# EAGLE design Nixie_noTube_final (EAGLE 7.6.0)
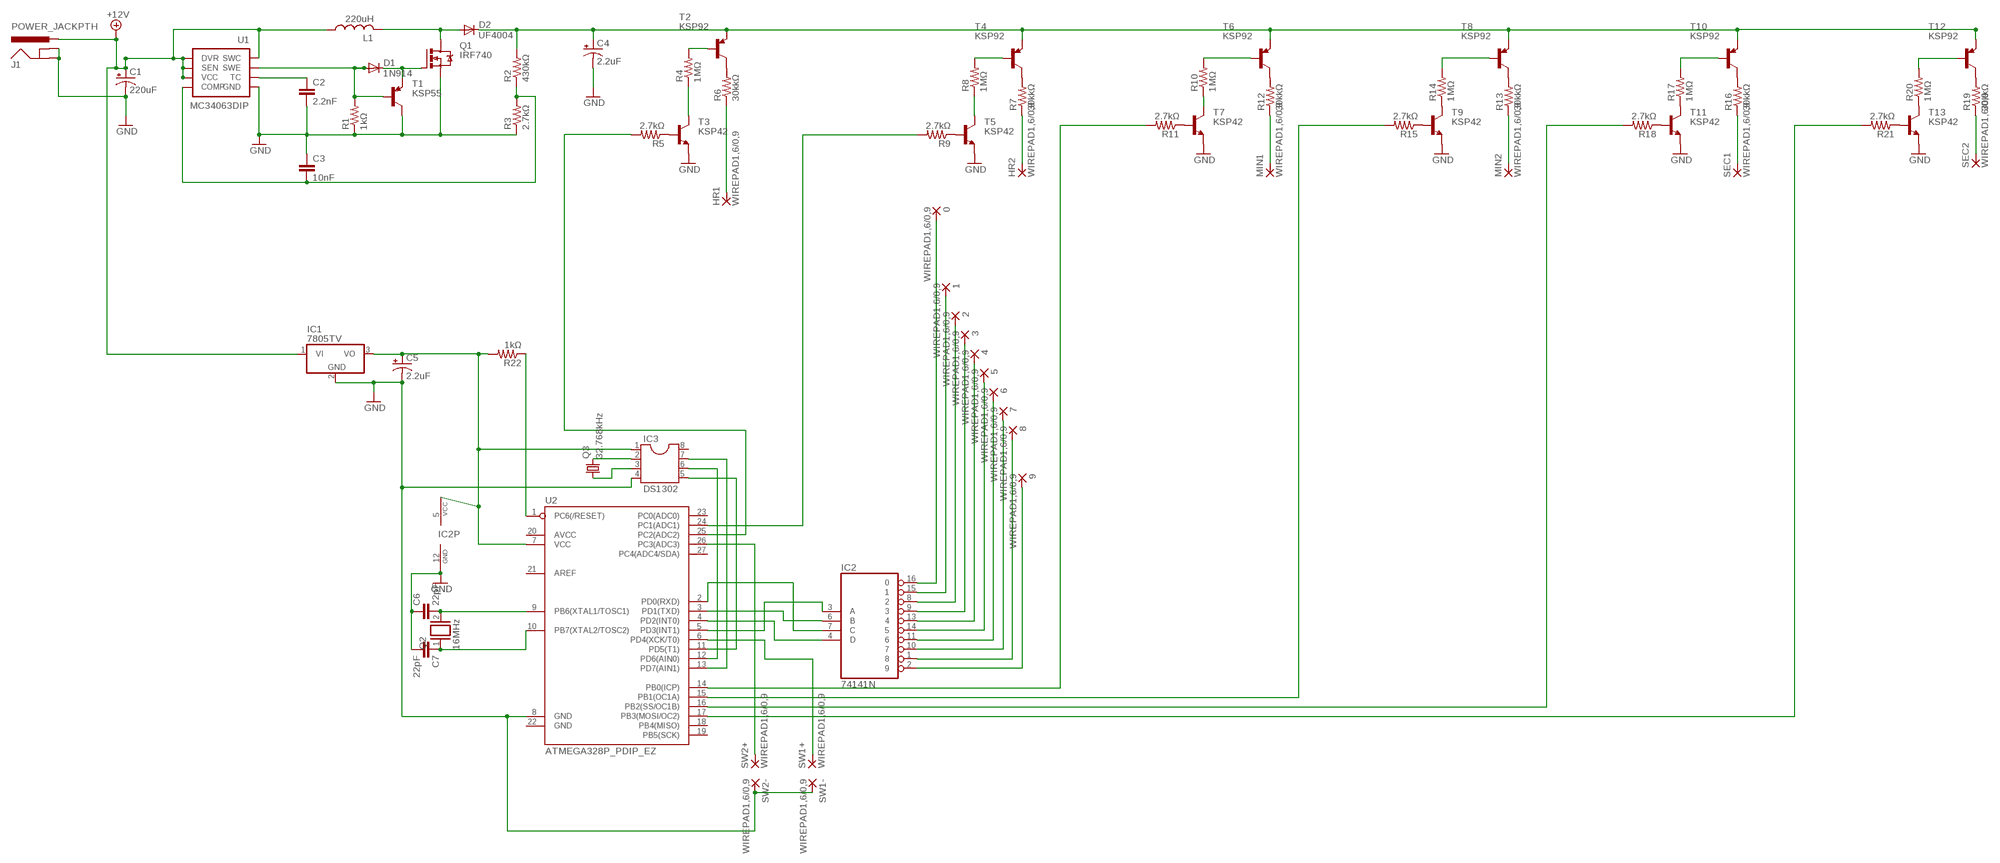
[diagram p0: schematic, sheet 1]

## Parts
0  WIREPAD1,6/0,9  [1,6/0,9]
1  WIREPAD1,6/0,9  [1,6/0,9]
2  WIREPAD1,6/0,9  [1,6/0,9]
3  WIREPAD1,6/0,9  [1,6/0,9]
4  WIREPAD1,6/0,9  [1,6/0,9]
5  WIREPAD1,6/0,9  [1,6/0,9]
6  WIREPAD1,6/0,9  [1,6/0,9]
7  WIREPAD1,6/0,9  [1,6/0,9]
8  WIREPAD1,6/0,9  [1,6/0,9]
9  WIREPAD1,6/0,9  [1,6/0,9]
C1  220uF  CAP_POLPTH1  [CPOL-RADIAL-100UF-25V]
C2  2.2nF  CAPEZ  [CAP-PTH-SMALLEZ]
C3  10nF  CAPEZ  [CAP-PTH-SMALLEZ]
C4  2.2uF  CAP_POLPTH1  [CPOL-RADIAL-100UF-25V]
C5  2.2uF  CAP_POLPTH1  [CPOL-RADIAL-100UF-25V]
C6  22pF  C2,5-3  [C2.5-3]
C7  22pF  C2,5-3  [C2.5-3]
D1  1N914  1N4004  [DO41-10]
D2  UF4004  1N4004  [DO41-10]
HR1  WIREPAD1,6/0,9  [1,6/0,9]
HR2  WIREPAD1,6/0,9  [1,6/0,9]
IC1  7805TV  [TO220V]
IC2  74141N  [DIL16]
IC3  DS1302  DIL8  [DIL08]
J1  POWER_JACKPTH  [POWER_JACK_PTH]
L1  220uH  L-US6000-XXX-RC  [6000-XXXX-RC]
MIN1  WIREPAD1,6/0,9  [1,6/0,9]
MIN2  WIREPAD1,6/0,9  [1,6/0,9]
Q1  IRF740  [TO220BV]
Q2  16MHz  XTAL/S  [QS]
Q3  32.768kHz  CRYSTALTC26H  [TC26H]
R1  1kΩ  R-US_0204/7  [0204/7]
R2  430kΩ  R-US_0204/7  [0204/7]
R3  2.7kΩ  R-US_0204/7  [0204/7]
R4  1MΩ  R-US_0204/7  [0204/7]
R5  2.7kΩ  R-US_0204/7  [0204/7]
R6  30kkΩ  R-US_0204/7  [0204/7]
R7  30kkΩ  R-US_0204/7  [0204/7]
R8  1MΩ  R-US_0204/7  [0204/7]
R9  2.7kΩ  R-US_0204/7  [0204/7]
R10  1MΩ  R-US_0204/7  [0204/7]
R11  2.7kΩ  R-US_0204/7  [0204/7]
R12  30kkΩ  R-US_0204/7  [0204/7]
R13  30kkΩ  R-US_0204/7  [0204/7]
R14  1MΩ  R-US_0204/7  [0204/7]
R15  2.7kΩ  R-US_0204/7  [0204/7]
R16  30kkΩ  R-US_0204/7  [0204/7]
R17  1MΩ  R-US_0204/7  [0204/7]
R18  2.7kΩ  R-US_0204/7  [0204/7]
R19  30kkΩ  R-US_0204/7  [0204/7]
R20  1MΩ  R-US_0204/7  [0204/7]
R21  2.7kΩ  R-US_0204/7  [0204/7]
R22  1kΩ  R-US_0204/7  [0204/7]
SEC1  WIREPAD1,6/0,9  [1,6/0,9]
SEC2  WIREPAD1,6/0,9  [1,6/0,9]
SW1+  WIREPAD1,6/0,9  [1,6/0,9]
SW1-  WIREPAD1,6/0,9  [1,6/0,9]
SW2+  WIREPAD1,6/0,9  [1,6/0,9]
SW2-  WIREPAD1,6/0,9  [1,6/0,9]
T1  KSP55  -PNP-TO92-EBC  [TO92-EBC]
T2  KSP92  -PNP-TO92  [TO92]
T3  KSP42  -NPN-TO92  [TO92]
T4  KSP92  -PNP-TO92  [TO92]
T5  KSP42  -NPN-TO92  [TO92]
T6  KSP92  -PNP-TO92  [TO92]
T7  KSP42  -NPN-TO92  [TO92]
T8  KSP92  -PNP-TO92  [TO92]
T9  KSP42  -NPN-TO92  [TO92]
T10  KSP92  -PNP-TO92  [TO92]
T11  KSP42  -NPN-TO92  [TO92]
T12  KSP92  -PNP-TO92  [TO92]
T13  KSP42  -NPN-TO92  [TO92]
U1  MC34063DIP  [DIP-08]
U2  ATMEGA328P_PDIP_EZ  [DIL28-EZ]

## Nets
200V: C4.1(+) D2.C R2.2 T2.1(E) T4.1(E) T6.1(E) T8.1(E) T10.1(E) T12.1(E)
+12V: C1.1(+) IC1.1(VI) J1.PWR L1.1 U1.1(SWC) U1.6(VCC) U1.7(SEN) U1.8(DVR)
GND: C1.2(-) C2.2 C3.1 C4.2(-) C5.2(-) C6.1 C7.2 IC1.2(GND) IC2.12(GND) IC3.4 J1.GND J1.GNDBREAK Q1.S R1.1 R3.1 SW1-.1(P) SW2-.1(P) T1.C T3.1(E) T5.1(E) T7.1(E) T9.1(E) T11.1(E) T13.1(E) U1.4(GND) U2.8(GND)
H1: HR2.1(P) R7.1
N$1: C2.1 U1.3(TC)
N$2: C3.2 R2.1 R3.2 U1.5(COMP)
N$3: D1.A R1.2 T1.B U1.2(SWE)
N$4: D1.C Q1.G T1.E
N$5: D2.A L1.2 Q1.D
N$6: R19.1 SEC2.1(P)
N$7: R11.1 T7.2(B)
N$8: R6.2 T2.3(C)
N$9: R4.2 T2.2(B)
N$10: R4.1 T3.3(C)
N$11: R5.1 T3.2(B)
N$12: HR1.1(P) R6.1
N$13: R7.2 T4.3(C)
N$14: R9.1 T5.2(B)
N$15: R8.2 T4.2(B)
N$16: R8.1 T5.3(C)
N$18: R12.2 T6.3(C)
N$19: R10.1 T7.3(C)
N$20: MIN1.1(P) R12.1
N$21: R10.2 T6.2(B)
N$22: R13.2 T8.3(C)
N$23: R14.1 T9.3(C)
N$24: R15.1 T9.2(B)
N$25: R14.2 T8.2(B)
N$26: MIN2.1(P) R13.1
N$27: R16.2 T10.3(C)
N$28: R17.1 T11.3(C)
N$29: R18.1 T11.2(B)
N$30: R17.2 T10.2(B)
N$31: R16.1 SEC1.1(P)
N$32: R19.2 T12.3(C)
N$33: R20.1 T13.3(C)
N$34: R21.1 T13.2(B)
N$35: R20.2 T12.2(B)
N$37: R22.1 U2.1(PC6(/RESET))
N$38: C5.1(+) IC1.3(VO) IC2.5(VCC) IC3.1 R22.2 U2.7(VCC)
N$39: IC2.6(B) U2.3(PD1(TXD))
N$40: C6.2 Q2.2 U2.9(PB6(XTAL1/TOSC1))
N$41: C7.1 Q2.1 U2.10(PB7(XTAL2/TOSC2))
N$42: IC2.7(C) U2.2(PD0(RXD))
N$43: IC2.4(D) U2.4(PD2(INT0))
N$44: IC2.3(A) U2.5(PD3(INT1))
N$45: 0.1(P) IC2.16
N$46: 1.1(P) IC2.15
N$47: 2.1(P) IC2.8
N$48: 3.1(P) IC2.9
N$49: 4.1(P) IC2.13
N$50: 5.1(P) IC2.14
N$51: 6.1(P) IC2.11
N$52: 7.1(P) IC2.10
N$53: 8.1(P) IC2.1
N$54: 9.1(P) IC2.2
N$55: SW1+.1(P) U2.6(PD4(XCK/T0))
N$56: SW2+.1(P) U2.26(PC3(ADC3))
N$57: R5.2 U2.25(PC2(ADC2))
N$58: R9.2 U2.24(PC1(ADC1))
N$59: R11.2 U2.14(PB0(ICP))
N$60: R15.2 U2.15(PB1(OC1A))
N$61: R18.2 U2.16(PB2(SS/OC1B))
N$62: R21.2 U2.17(PB3(MOSI/OC2))
N$63: IC3.2 Q3.2
N$64: IC3.3 Q3.1
N$66: IC3.5 U2.11(PD5(T1))
N$67: IC3.6 U2.12(PD6(AIN0))
N$68: IC3.7 U2.13(PD7(AIN1))
Unconnected: IC3.8 U2.18(PB4(MISO)) U2.19(PB5(SCK)) U2.20(AVCC) U2.21(AREF) U2.22(GND) U2.23(PC0(ADC0)) U2.27(PC4(ADC4/SDA))

## Library data of the parts
0 1-9 HR1 HR2 MIN1 MIN2 SEC1 SEC2 SW1+ SW1- SW2+ SW2- = wirepad:WIREPAD: Wire PAD connect wire on PCB
C1 C4 C5 = SparkFun-Capacitors:CAP_POL: Capacitor Polarized These are standard SMD and PTH capacitors. Normally 10uF, 47uF, and 100uF in electrolytic and tantalum varieties. Always verify the external diameter of the through hole cap, it varies with capacity, voltage, and manufacturer. The EIA devices should be standard.
C2 C3 = SparkFun-Capacitors:CAP: Capacitor Standard 0603 ceramic capacitor, and 0.1" leaded capacitor.
C6 C7 = capacitor-wima:C: CAPACITOR naming: grid - package width
D1 D2 = diode:1N4004: DIODE general purpose rectifier, 1 A
IC1 = linear:78*: Positive VOLTAGE REGULATOR Source: http://cache.national.com/ds/LM/LM78L05.pdf http://www.fairchildsemi.com/ds/LM/LM7805.pdf
IC2 = 74xx-us:74*141: BCD to decimal DECODER/DRIVER
IC3 = ic-package:DIL8: Dual In Line / Socket
J1 = SparkFun-Connectors:POWER_JACK: Power Jack This is the standard 5.5mm barrel jack for power. The PTH is the most common, proven, reliable, footprint. The Slot footprint only works if the mill layer is transmitted to the PCB fab house so be warned. Mating wall wart : TOL-00298 (and others); PROD_ID: CONN-08197
L1 = rcl:L-US: INDUCTOR, American symbol
Q1 = transistor-power:IRF740: N-CHANNEL MOS FET
Q2 = special:XTAL/S: CRYSTAL
Q3 = crystal:CRYSTAL: CRYSTAL; OC_FARNELL: unknown; OC_NEWARK: unknown
R1-R22 = resistor:R-US_: RESISTOR, American symbol
T1 = transistor-neu-to92:*-PNP-: PNP Transistror
T2 T4 T6 T8 T10 T12 = transistor:*-PNP-: PNP Transistror
T3 T5 T7 T9 T11 T13 = transistor:*-NPN-: NPN Transistror BF959 corrected 2008.03.06
U1 = SparkFun-PowerIC:MC34063: Jellybean switching supply controller
U2 = SparkFun-DigitalIC:ATMEGA328P_PDIP_EZ: uC used in the Arduino 32kb flash, 1k EEPROM, 2k SRAM This is the through-hole version of this chip.

## Board
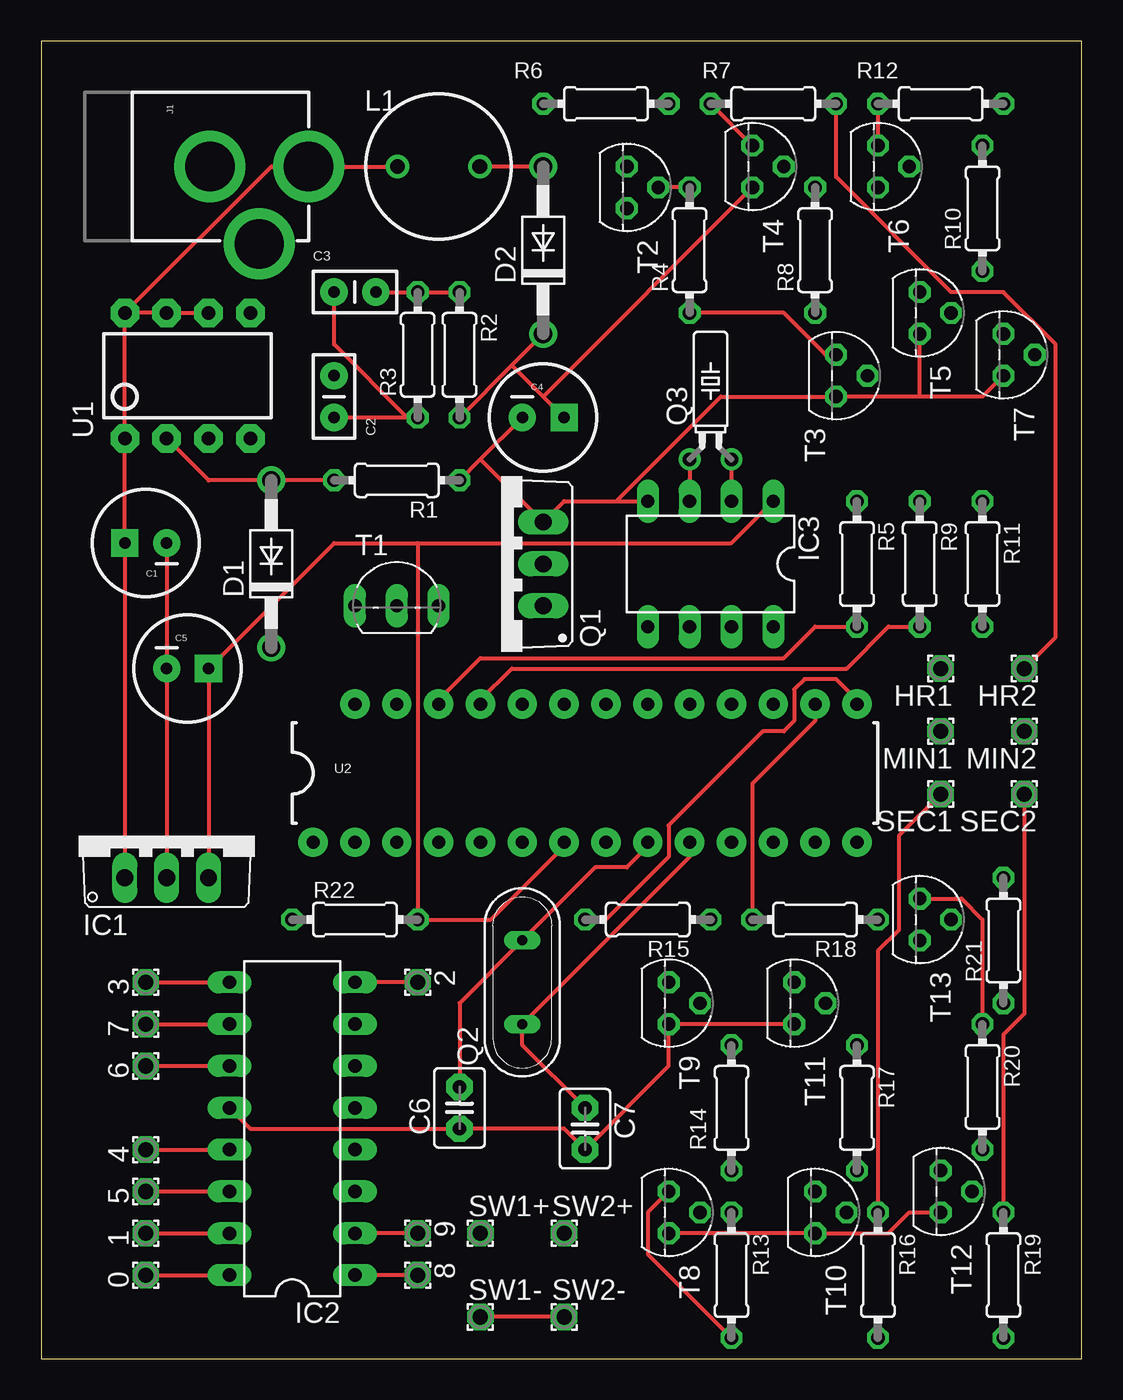
[diagram p1: board, top side]
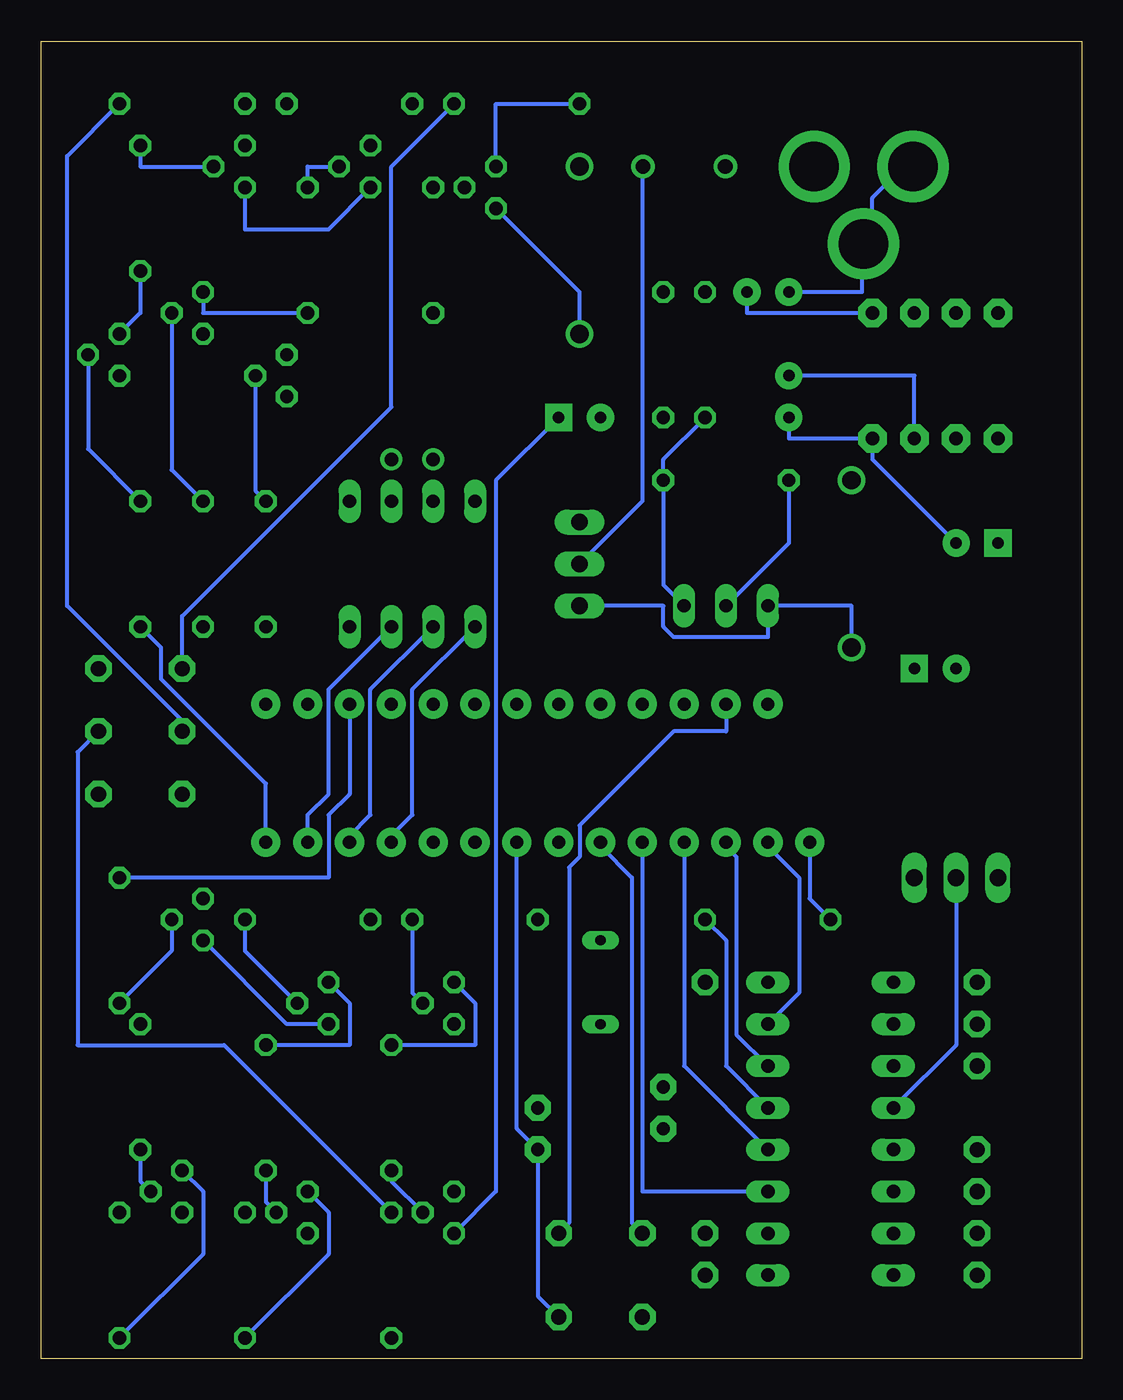
[diagram p2: board, bottom side, seen from below]

Size 63.17 x 80 mm. Coordinates in mm from the lower left corner, seen from the top.
Outline: 0,0 63.17,0 63.17,80 0,80 0,0
Copper layers (1*16): Top 0.035mm / dielectric 1.5mm / Bottom 0.035mm
Design rules "default": minimum track width 10mil, minimum drill 24mil, track to track 8mil, track to pad 8mil, pad to pad 8mil, via to via 8mil, smd to smd 8mil, copper to edge 40mil, drill to drill 8mil, minimum pad ring 10mil, minimum via ring 8mil, stop-mask expansion 4mil, vias tented up to drill 0mil, thermal gap 10mil

### Footprints (pad centres in the part's own frame; a part is rotated, then mirrored left to right if it is on the bottom)
1,6/0,9 = drill 0.914 pad 1.6 octagon: 1 0,0
CPOL-RADIAL-100UF-25V = drill 0.7 pad 1.651 square: 1 1.27,0 | drill 0.7 pad 1.651: 2 -1.27,0
CAP-PTH-SMALLEZ = drill 0.7 pad 1.651: 1 0,0; 2 2.54,0
C2.5-3 = drill 0.813 pad 1.6 octagon: 1 -1.27,0; 2 1.27,0
DO41-10 = drill 1.118: A 5.08,0; C -5.08,0
TO220V = drill 1.016 long: 1 -2.54,-2.54; 2 0,-2.54; 3 2.54,-2.54
DIL16 = drill 0.813 long: 1 -8.89,-3.81; 2 -6.35,-3.81; 3 -3.81,-3.81; 4 -1.27,-3.81; 5 1.27,-3.81; 6 3.81,-3.81; 7 6.35,-3.81; 8 8.89,-3.81; 9 8.89,3.81; 10 6.35,3.81; 11 3.81,3.81; 12 1.27,3.81; 13 -1.27,3.81; 14 -3.81,3.81; 15 -6.35,3.81; 16 -8.89,3.81
DIL08 = drill 0.813 long: 1 -3.81,-3.81; 2 -1.27,-3.81; 3 1.27,-3.81; 4 3.81,-3.81; 5 3.81,3.81; 6 1.27,3.81; 7 -1.27,3.81; 8 -3.81,3.81
POWER_JACK_PTH = drill 2.997 pad 4.318: GND 0,7.7; GNDBREAK 4.7,10.7; PWR 0,13.7
6000-XXXX-RC = drill 0.9 pad 1.422: 1 -2.5,0; 2 2.5,0
TO220BV = drill 1.016 long: D 0,-2.54; G -2.54,-2.54; S 2.54,-2.54
QS = drill 0.61 long: 1 -2.54,0; 2 2.54,0
TC26H = drill 0.813: 1 -1.27,0; 2 1.27,0
0204/7 = drill 0.813 octagon: 1 -3.81,0; 2 3.81,0
TO92-EBC = drill 0.813 long: B 0,-1.27; C 2.54,-1.27; E -2.54,-1.27
TO92 = drill 0.813 octagon: 1 1.27,0; 2 0,1.905; 3 -1.27,0
DIP-08 = drill 0.813 pad 1.727 octagon: 1 -3.81,-3.81; 2 -1.27,-3.81; 3 1.27,-3.81; 4 3.81,-3.81; 5 3.81,3.81; 6 1.27,3.81; 7 -1.27,3.81; 8 -3.81,3.81
DIL28-EZ = drill 0.8 pad 1.778: 1 -16.51,-4.191; 2 -13.97,-4.191; 3 -11.43,-4.191; 4 -8.89,-4.191; 5 -6.35,-4.191; 6 -3.81,-4.191; 7 -1.27,-4.191; 8 1.27,-4.191; 9 3.81,-4.191; 10 6.35,-4.191; 11 8.89,-4.191; 12 11.43,-4.191; 13 13.97,-4.191; 14 16.51,-4.191; 15 16.51,4.191; 16 13.97,4.191; 17 11.43,4.191; 18 8.89,4.191; 19 6.35,4.191; 20 3.81,4.191; 21 1.27,4.191; 22 -1.27,4.191; 23 -3.81,4.191; 24 -6.35,4.191; 25 -8.89,4.191; 26 -11.43,4.191; 27 -13.97,4.191

### Placement (x,y rotation side)
0  6.35,5.08 90 top
1  6.35,7.62 90 top
2  22.86,22.86 270 top
3  6.35,22.86 90 top
4  6.35,12.7 90 top
5  6.35,10.16 90 top
6  6.35,17.78 90 top
7  6.35,20.32 90 top
8  22.86,5.08 270 top
9  22.86,7.62 270 top
C1  6.35,49.53 180 top
C2  17.78,59.69 270 top
C3  17.78,64.77 0 top
C4  30.48,57.15 0 top
C5  8.89,41.91 0 top
C6  25.4,15.24 90 top
C7  33.02,13.97 270 top
D1  13.97,48.26 90 top
D2  30.48,67.31 90 top
HR1  54.61,41.91 180 top
HR2  59.69,41.91 180 top
IC1  7.62,31.75 0 top
IC2  15.24,13.97 90 top
IC3  40.64,48.26 180 top
J1  2.54,72.39 270 top
L1  24.13,72.39 0 top
MIN1  54.61,38.1 180 top
MIN2  59.69,38.1 180 top
Q1  27.94,48.26 90 top
Q2  29.21,22.86 90 top
Q3  40.64,54.61 0 top
R1  21.59,53.34 180 top
R2  25.4,60.96 270 top
R3  22.86,60.96 90 top
R4  39.37,67.31 90 top
R5  49.53,48.26 270 top
R6  34.29,76.2 180 top
R7  44.45,76.2 180 top
R8  46.99,67.31 90 top
R9  53.34,48.26 270 top
R10  57.15,69.85 90 top
R11  57.15,48.26 270 top
R12  54.61,76.2 180 top
R13  41.91,5.08 270 top
R14  41.91,15.24 270 top
R15  36.83,26.67 180 top
R16  50.8,5.08 270 top
R17  49.53,15.24 270 top
R18  46.99,26.67 180 top
R19  58.42,5.08 270 top
R20  57.15,16.51 270 top
R21  58.42,25.4 90 top
R22  19.05,26.67 0 top
SEC1  54.61,34.29 180 top
SEC2  59.69,34.29 180 top
SW1+  26.67,7.62 0 top
SW1-  26.67,2.54 0 top
SW2+  31.75,7.62 0 top
SW2-  31.75,2.54 0 top
T1  21.59,46.99 0 top
T2  35.56,71.12 270 top
T3  48.26,59.69 270 top
T4  43.18,72.39 270 top
T5  53.34,63.5 270 top
T6  50.8,72.39 270 top
T7  58.42,60.96 270 top
T8  38.1,8.89 270 top
T9  38.1,21.59 270 top
T10  46.99,8.89 270 top
T11  45.72,21.59 270 top
T12  54.61,10.16 270 top
T13  53.34,26.67 270 top
U1  8.89,59.69 0 top
U2  33.02,35.56 0 top

### Tracks (layer width: path | path; a pad name or v marks a point on that pad's centre or on a via)
200V
  Top 0.254: T8.1 T10.1 51.44,7.62 52.7,8.89 T12.1 | D2.C 28.57,60.33 | 28.57,60.33 R2.2 | 28.57,60.33 30.48,58.42 | 30.48,58.42 C4.1 | 30.48,58.42 T4.1
  Bottom 0.254: T4.1 45.72,68.58 50.8,68.58 T6.1 | T2.1 30.48,64.77 D2.C | T8.1 35.56,10.16 35.56,53.34 C4.1
+12V
  Top 0.254: L1.1 J1.PWR 13.97,72.39 U1.8 | U1.8 U1.7 U1.6 | IC1.1 C1.1 U1.1 U1.8
GND
  Top 0.254: T11.1 T9.1 38.1,17.78 C7.2 31.75,13.97 C6.1 12.7,13.97 IC2.12 | SW2-.1 SW1-.1 | 53.34,58.42 57.15,58.42 T7.1 | 53.34,58.42 T3.1 41.27,58.42 34.92,52.07 | 53.34,58.42 T5.1 | C1.2 C5.2 IC1.2 | 34.92,52.07 31.75,52.07 Q1.S 26.67,54.61 | 34.92,52.07 IC3.4 | 22.23,57.15 C2.2 | R1.1 26.67,54.61 | 26.67,54.61 C4.2 | C3.1 17.78,61.59 22.23,57.15 | 22.23,57.15 R3.1
  Bottom 0.254: T13.1 48.26,20.32 T11.1 | U2.8 34.29,13.97 C7.2 33.02,3.81 SW2-.1 | C3.1 13.34,64.77 13.34,67.31 J1.GNDBREAK 12.7,67.94 12.7,70.48 10.79,72.39 J1.GND | IC2.12 7.62,19.05 IC1.2 | T1.C 25.4,46.99 R1.1 25.4,54.61 R3.1 | C2.2 17.78,55.88 U1.4 12.7,54.61 C1.2
H1
  Top 0.254: R7.1 48.26,71.75 55.24,64.77 58.42,64.77 61.59,61.59 61.59,43.81 HR2.1
N$1
  Bottom 0.254: C2.1 10.16,59.69 U1.3
N$2
  Top 0.254: C3.2 R3.2 R2.1
  Bottom 0.254: U1.5 20.32,63.5 C3.2
N$3
  Top 0.254: R1.2 D1.A 10.16,53.34 U1.2
  Bottom 0.254: T1.B 17.78,49.53 R1.2
N$4
  Bottom 0.254: D1.C 13.97,45.72 T1.E 19.05,43.81 24.77,43.81 25.4,44.45 25.4,45.72 Q1.G
N$5
  Top 0.254: D2.A L1.2
  Bottom 0.254: Q1.D 26.67,52.07 26.67,72.39 L1.2
N$6
  Top 0.254: R19.1 58.42,19.68 59.69,20.95 SEC2.1
N$7
  Bottom 0.254: R11.1 60.33,55.24 T7.2
N$8
  Bottom 0.254: R6.2 35.56,76.2 T2.3
N$9
  Top 0.254: R4.2 T2.2
N$10
  Top 0.254: R4.1 45.09,63.5 47.62,60.96 T3.3
N$11
  Bottom 0.254: R5.1 50.16,52.7 T3.2
N$12
  Bottom 0.254: R6.1 41.91,72.39 41.91,57.78 54.61,45.09 HR1.1
N$13
  Top 0.254: R7.2 T4.3
N$14
  Bottom 0.254: R9.1 55.24,53.98 T5.2
N$15
  Bottom 0.254: T4.2 46.99,72.39 R8.2
N$16
  Bottom 0.254: R8.1 53.34,63.5 T5.3
N$18
  Top 0.254: R12.2 T6.3
N$19
  Bottom 0.254: T7.3 57.15,63.5 R10.1
N$20
  Bottom 0.254: R12.1 61.59,73.03 61.59,45.72 54.61,38.73 MIN1.1
N$21
  Bottom 0.254: T6.2 57.15,72.39 R10.2
N$22
  Top 0.254: R13.2 36.83,6.35 36.83,8.89 T8.3
N$23
  Bottom 0.254: R14.1 36.83,19.05 36.83,21.59 T9.3
N$24
  Bottom 0.254: T9.2 40.64,22.23 R15.1
N$25
  Bottom 0.254: T8.2 41.91,10.79 R14.2
N$26
  Bottom 0.254: R13.1 52.07,19.05 60.96,19.05 60.96,36.83 MIN2.1
N$27
  Bottom 0.254: R16.2 45.72,6.35 45.72,8.89 T10.3
N$28
  Bottom 0.254: R17.1 44.45,19.05 44.45,21.59 T11.3
N$29
  Bottom 0.254: T11.2 50.8,24.77 R18.1
N$30
  Bottom 0.254: T10.2 49.53,9.53 R17.2
N$31
  Top 0.254: R16.1 50.8,24.77 52.07,26.04 52.07,31.75 SEC1.1
N$32
  Bottom 0.254: R19.2 53.34,6.35 53.34,10.16 T12.3
N$33
  Top 0.254: R20.1 57.15,26.67 55.88,27.94 T13.3
N$34
  Bottom 0.254: R21.1 55.24,24.77 T13.2
N$35
  Bottom 0.254: T12.2 57.15,10.79 R20.2
N$37
  Bottom 0.254: R22.1 16.51,27.94 U2.1
N$38
  Top 0.254: U2.7 31.75,31.11 27.3,26.67 R22.2 22.86,49.53 | IC3.1 41.91,49.53 22.86,49.53 | 22.86,49.53 17.78,49.53 C5.1 IC1.3
  Bottom 0.254: IC2.5 21.59,17.78 21.59,25.4 R22.2
N$39
  Bottom 0.254: IC2.6 20.95,19.68 20.95,30.48 21.59,31.11 U2.3
N$40
  Top 0.254: U2.9 36.83,31.11 35.56,29.84 33.66,29.84 Q2.2 25.4,21.59 C6.2
N$41
  Top 0.254: C7.1 29.21,19.05 Q2.1 39.37,30.48 U2.10
N$42
  Bottom 0.254: IC2.7 17.14,22.23 17.14,29.21 19.05,31.11 U2.2
N$43
  Bottom 0.254: IC2.4 24.13,17.78 U2.4
N$44
  Bottom 0.254: IC2.3 26.67,10.16 U2.5
N$45
  Top 0.254: 0.1 IC2.16
N$46
  Top 0.254: 1.1 IC2.15
N$47
  Top 0.254: 2.1 IC2.8
N$48
  Top 0.254: 3.1 IC2.9
N$49
  Top 0.254: 4.1 IC2.13
N$50
  Top 0.254: 5.1 IC2.14
N$51
  Top 0.254: 6.1 IC2.11
N$52
  Top 0.254: 7.1 IC2.10
N$53
  Top 0.254: 8.1 IC2.1
N$54
  Top 0.254: 9.1 IC2.2
N$55
  Bottom 0.254: SW1+.1 27.3,8.26 27.3,29.21 29.21,31.11 U2.6
N$56
  Bottom 0.254: SW2+.1 31.11,8.26 31.11,29.84 30.48,30.48 30.48,32.38 24.77,38.1 21.59,38.1 U2.26
N$57
  Top 0.254: R5.2 46.99,44.45 45.09,42.55 26.67,42.55 24.13,40.01 U2.25
N$58
  Top 0.254: R9.2 51.44,44.45 48.9,41.91 28.57,41.91 26.67,40.01 U2.24
N$59
  Bottom 0.254: R11.2 55.88,43.18 55.88,41.27 49.53,34.92 U2.14
N$60
  Top 0.254: R15.2 34.29,26.67 38.1,30.48 38.1,32.38 43.81,38.1 45.09,38.1 45.72,38.73 45.72,40.64 46.35,41.27 48.26,41.27 49.53,40.01 U2.15
N$61
  Top 0.254: R18.2 43.18,34.92 46.99,38.73 U2.16
N$62
  Bottom 0.254: R21.2 45.72,29.21 45.72,33.02 44.45,34.29 U2.17
N$63
  Top 0.254: Q3.2 IC3.2
N$64
  Top 0.254: Q3.1 IC3.3
N$66
  Bottom 0.254: IC3.5 40.64,40.64 40.64,33.02 41.91,31.75 U2.11
N$67
  Bottom 0.254: IC3.6 43.18,40.64 43.18,33.02 44.45,31.75 U2.12
N$68
  Bottom 0.254: IC3.7 45.72,40.64 45.72,34.29 46.99,33.02 U2.13